# EAGLE design Heater_w0.26_s0.4 (EAGLE 6.3)
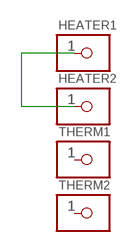
[diagram p0: schematic, sheet 1]

## Parts
HEATER1  1X01P2  [1X01_1X2_PAD]
HEATER2  1X01P2  [1X01_1X2_PAD]
THERM1  1X01P2  [1X01_1X2_PAD]
THERM2  1X01P2  [1X01_1X2_PAD]

## Nets
HEAT_LINE: HEATER1.1 HEATER2.1
Unconnected: THERM1.1 THERM2.1

## Library data of the parts
HEATER1 HEATER2 THERM1 THERM2 = PIN:1X01

## Board
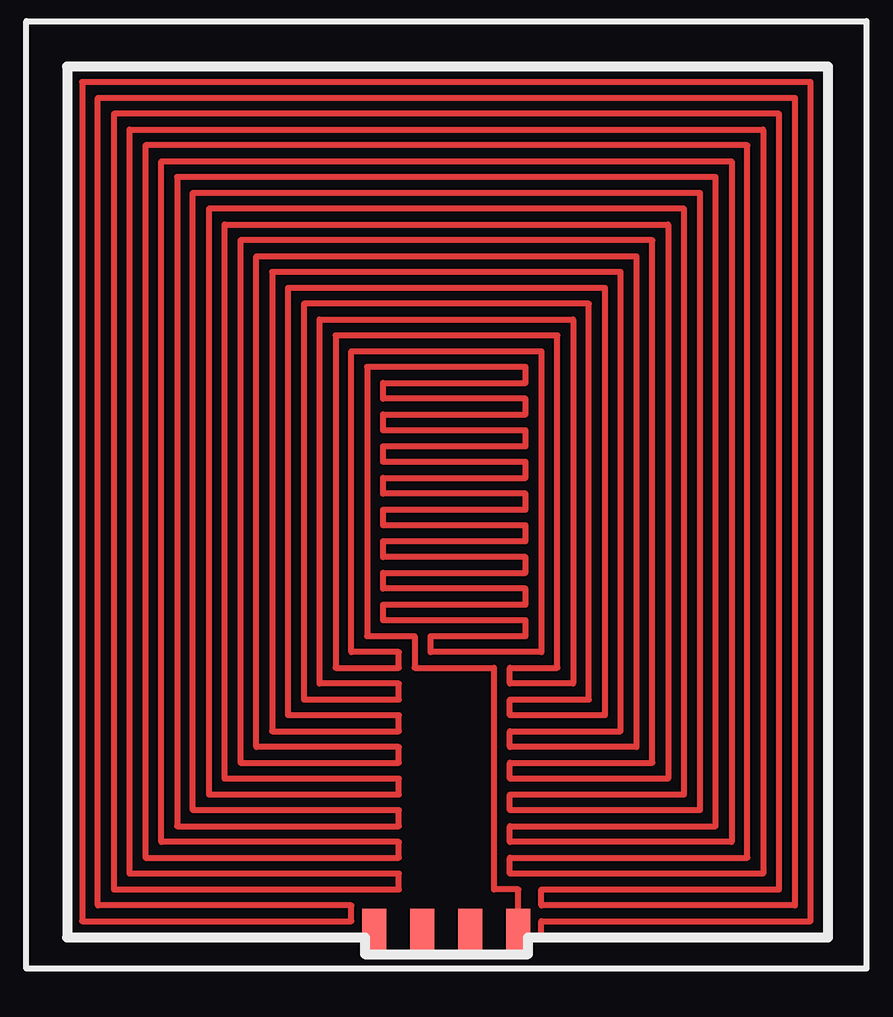
[diagram p1: board, top side]
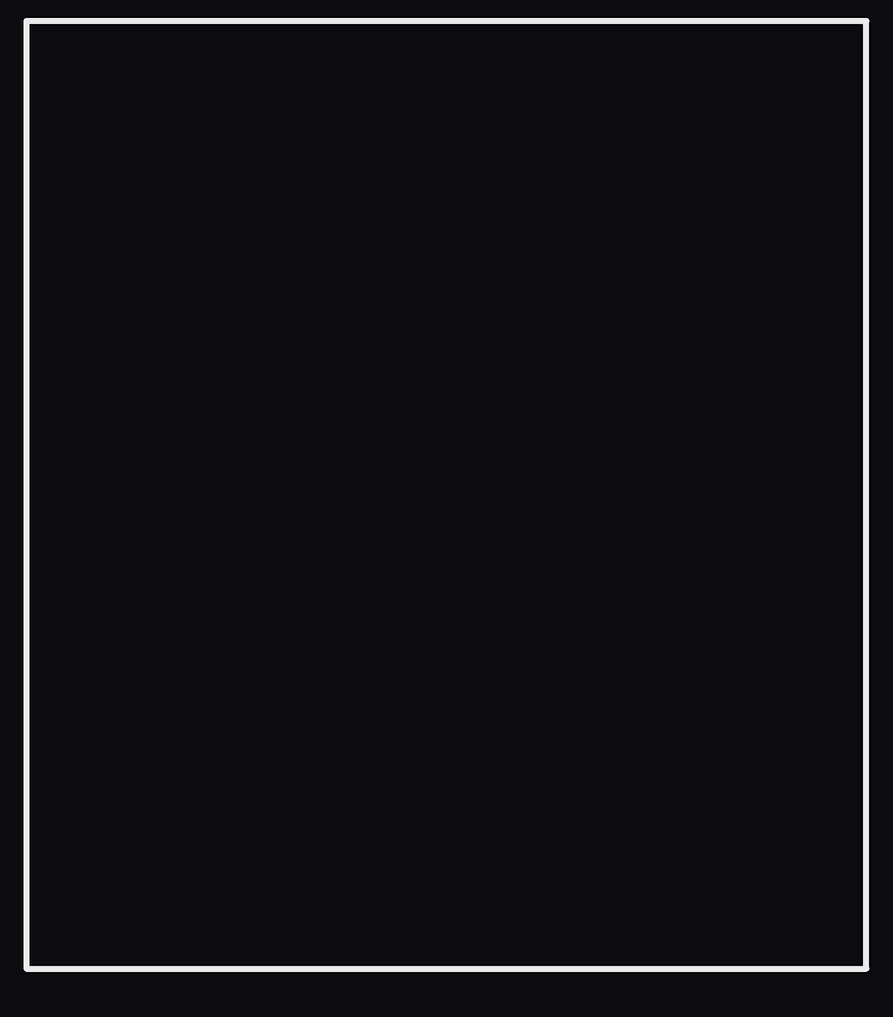
[diagram p2: board, bottom side, seen from below]

No outline drawn. Coordinates in mm, seen from the top.
Copper layers (1*16): Top 0.035mm / dielectric 1.5mm / Bottom 0.035mm
Design rules "Fusion_eagle_rule_v1.1": minimum track width 6mil, minimum drill 12mil, track to track 6mil, track to pad 6mil, pad to pad 6mil, via to via 6mil, smd to smd 0mil, copper to edge 10mil, drill to drill 10mil, minimum pad ring 10mil, minimum via ring 6mil, stop-mask expansion 2mil, vias tented up to drill 100mil, thermal gap 10mil

### Footprints (pad centres in the part's own frame; a part is rotated, then mirrored left to right if it is on the bottom)
1X01_1X2_PAD = smd 2 x 1: 1 0,0

### Placement (x,y rotation side)
HEATER1  -3,1.5 90 top
HEATER2  3,1.5 90 top
THERM1  1,1.5 90 top
THERM2  -1,1.5 90 top

### Tracks (layer width: path | path; a pad name or v marks a point on that pad's centre or on a via)
HEAT_LINE
  Top 0.26: HEATER1.1 -3,1.32 -15.84,1.32 -15.84,37.62 15.84,37.62 15.84,1.32 3.96,1.32 3.96,1.98 15.18,1.98 15.18,36.96 -15.18,36.96 -15.18,1.98 -3.96,1.98 -3.96,2.64 -14.52,2.64 -14.52,36.3 14.52,36.3 14.52,2.64 3.96,2.64 3.96,3.3 13.86,3.3 13.86,35.64 -13.86,35.64 -13.86,3.3 -1.98,3.3 -1.98,3.96 -13.2,3.96 -13.2,34.98 13.2,34.98 13.2,3.96 2.64,3.96 2.64,4.62 12.54,4.62 12.54,34.32 -12.54,34.32 -12.54,4.62 -1.98,4.62 -1.98,5.28 -11.88,5.28 -11.88,33.66 11.88,33.66 11.88,5.28 2.64,5.28 2.64,5.94 11.22,5.94 11.22,33 -11.22,33 -11.22,5.94 -1.98,5.94 -1.98,6.6 -10.56,6.6 -10.56,32.34 10.56,32.34 10.56,6.6 2.64,6.6 2.64,7.26 9.9,7.26 9.9,31.68 -9.9,31.68 -9.9,7.26 -1.98,7.26 -1.98,7.92 -9.24,7.92 -9.24,31.02 9.24,31.02 9.24,7.92 2.64,7.92 2.64,8.58 8.58,8.58 8.58,30.36 -8.58,30.36 -8.58,8.58 -1.98,8.58 -1.98,9.24 -7.92,9.24 -7.92,29.7 7.92,29.7 7.92,9.24 2.64,9.24 2.64,9.9 7.26,9.9 7.26,29.04 -7.26,29.04 -7.26,9.9 -1.98,9.9 -1.98,10.56 -6.6,10.56 -6.6,28.38 6.6,28.38 6.6,10.56 2.64,10.56 2.64,11.22 5.94,11.22 5.94,27.72 -5.94,27.72 -5.94,11.22 -1.98,11.22 -1.98,11.88 -5.28,11.88 -5.28,27.06 5.28,27.06 5.28,11.88 2.64,11.88 2.64,12.54 4.62,12.54 4.62,26.4 -4.62,26.4 -4.62,12.54 -1.98,12.54 -1.98,13.2 -3.96,13.2 -3.96,25.74 3.96,25.74 3.96,13.2 -0.66,13.2 -0.66,13.86 3.3,13.86 3.3,14.52 -2.64,14.52 -2.64,15.18 3.3,15.18 3.3,15.84 -2.64,15.84 -2.64,16.5 3.3,16.5 3.3,17.16 -2.64,17.16 -2.64,17.82 3.3,17.82 3.3,18.48 -2.64,18.48 -2.64,19.14 3.3,19.14 3.3,19.8 -2.64,19.8 -2.64,20.46 3.3,20.46 3.3,21.12 -2.64,21.12 -2.64,21.78 3.3,21.78 3.3,22.44 -2.64,22.44 -2.64,23.1 3.3,23.1 3.3,23.76 -2.64,23.76 -2.64,24.42 3.3,24.42 3.3,25.08 -3.3,25.08 -3.3,13.86 -1.32,13.86 -1.32,12.54 1.98,12.54 1.98,3.3 3,3.3 HEATER2.1